# Altium schematic sheet Ethernet.SchDoc
size A3
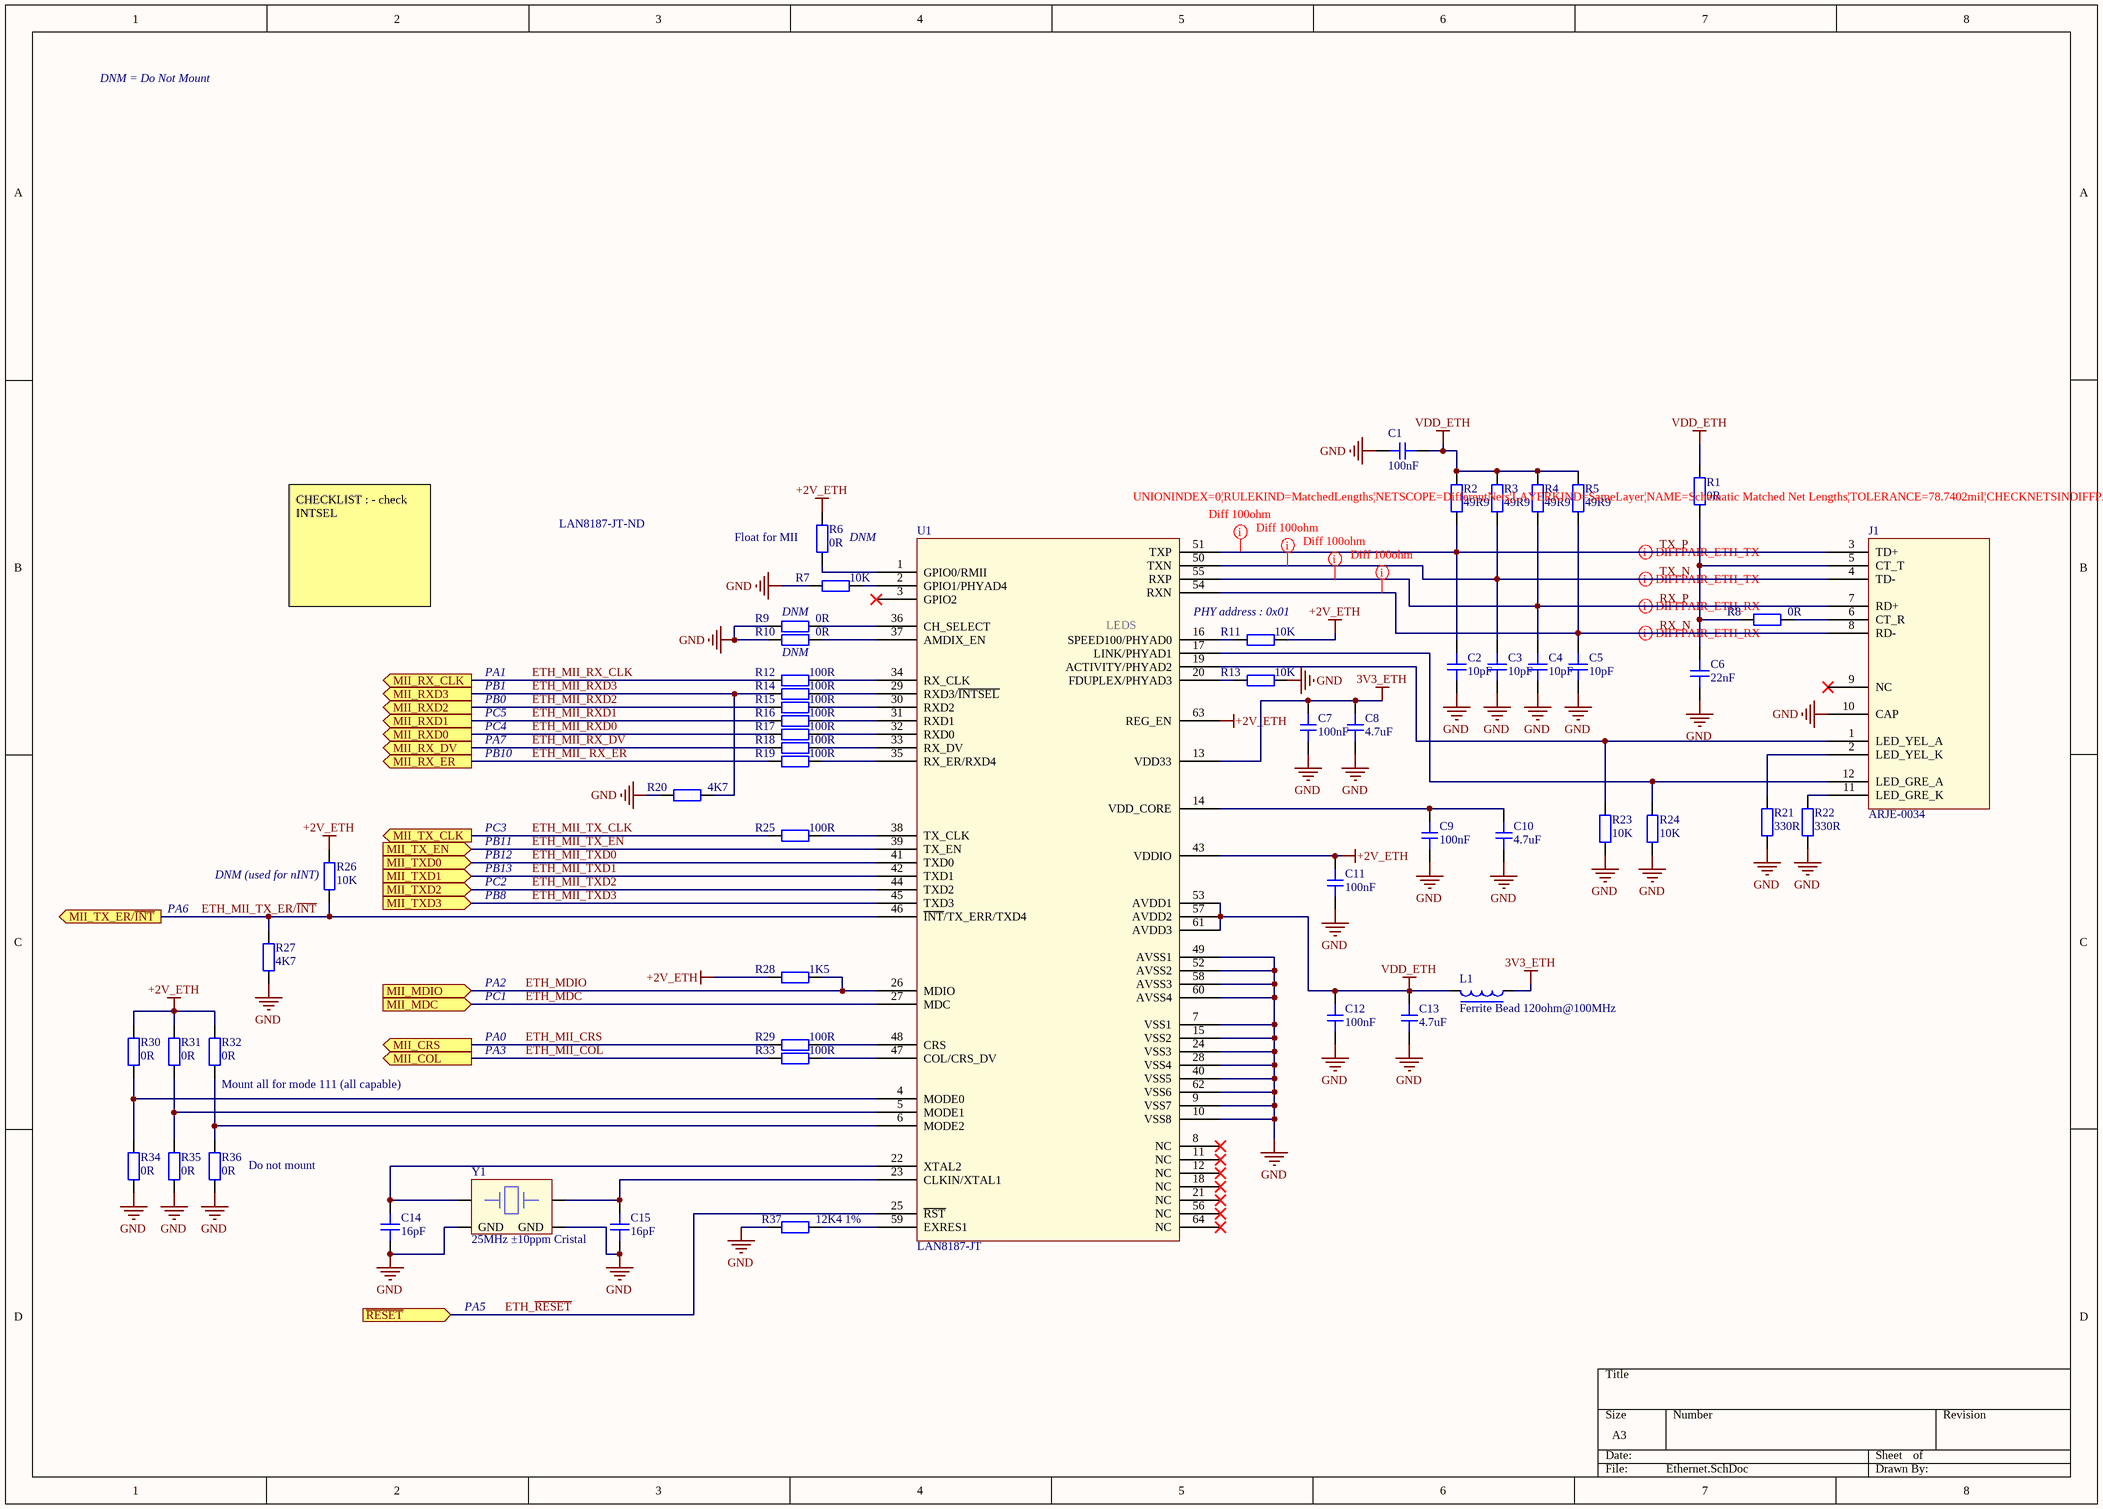
[diagram p0: Ethernet.SchDoc]

## Parts
C1  value 100nF  [Capacitor-0603]  (hidden comment: C-100nF-0603)
C2  value 10pF  [Capacitor-0603]  (hidden comment: C-10pF-0603)
C3  value 10pF  [Capacitor-0603]  (hidden comment: C-10pF-0603)
C4  value 10pF  [Capacitor-0603]  (hidden comment: C-10pF-0603)
C5  value 10pF  [Capacitor-0603]  (hidden comment: C-10pF-0603)
C6  value 22nF  [Capacitor-0603]  (hidden comment: C-22nF-0603)
C7  value 100nF  [Capacitor-0603]  (hidden comment: C-100nF-0603)
C8  value 4.7uF  [Capacitor-0603]  (hidden comment: C-4.7uF-0603)
C9  value 100nF  [Capacitor-0603]  (hidden comment: C-100nF-0603)
C10  value 4.7uF  [Capacitor-0603]  (hidden comment: C-4.7uF-0603)
C11  value 100nF  [Capacitor-0603]  (hidden comment: C-100nF-0603)
C12  value 100nF  [Capacitor-0603]  (hidden comment: C-100nF-0603)
C13  value 4.7uF  [Capacitor-0603]  (hidden comment: C-4.7uF-0603)
C14  value 16pF  [Capacitor-0603]  (hidden comment: C-16pF-0603)
C15  value 16pF  [Capacitor-0603]  (hidden comment: C-16pF-0603)
J1  ARJE-0034  [ARJE-0034]
L1  Ferrite Bead 120ohm@100MHz  [Inductor-0603]
R1  value 0R  [Resistor-0603]  (hidden comment: R-0R-0603)
R2  value 49R9  [Resistor-0603]  (hidden comment: R-49R9-0603)
R3  value 49R9  [Resistor-0603]  (hidden comment: R-49R9-0603)
R4  value 49R9  [Resistor-0603]  (hidden comment: R-49R9-0603)
R5  value 49R9  [Resistor-0603]  (hidden comment: R-49R9-0603)
R6  value 0R  [Resistor-0603]  (hidden comment: R-0R-0603)
R7  value 10K  [Resistor-0603]  (hidden comment: R-10K-0603)
R8  value 0R  [Resistor-0603]  (hidden comment: R-0R-0603)
R9  value 0R  [Resistor-0603]  (hidden comment: R-0R-0603)
R10  value 0R  [Resistor-0603]  (hidden comment: R-0R-0603)
R11  value 10K  [Resistor-0603]  (hidden comment: R-10K-0603)
R12  value 100R  [Resistor-0603]  (hidden comment: R-100R-0603)
R13  value 10K  [Resistor-0603]  (hidden comment: R-10K-0603)
R14  value 100R  [Resistor-0603]  (hidden comment: R-100R-0603)
R15  value 100R  [Resistor-0603]  (hidden comment: R-100R-0603)
R16  value 100R  [Resistor-0603]  (hidden comment: R-100R-0603)
R17  value 100R  [Resistor-0603]  (hidden comment: R-100R-0603)
R18  value 100R  [Resistor-0603]  (hidden comment: R-100R-0603)
R19  value 100R  [Resistor-0603]  (hidden comment: R-100R-0603)
R20  value 4K7  [Resistor-0603]  (hidden comment: R-4K7-0603)
R21  value 330R  [Resistor-0603]  (hidden comment: R-330R-0603)
R22  value 330R  [Resistor-0603]  (hidden comment: R-330R-0603)
R23  value 10K  [Resistor-0603]  (hidden comment: R-10K-0603)
R24  value 10K  [Resistor-0603]  (hidden comment: R-10K-0603)
R25  value 100R  [Resistor-0603]  (hidden comment: R-100R-0603)
R26  value 10K  [Resistor-0603]  (hidden comment: R-10K-0603)
R27  value 4K7  [Resistor-0603]  (hidden comment: R-4K7-0603)
R28  value 1K5  [Resistor-0603]  (hidden comment: R-1K5-0603)
R29  value 100R  [Resistor-0603]  (hidden comment: R-100R-0603)
R30  value 0R  [Resistor-0603]  (hidden comment: R-0R-0603)
R31  value 0R  [Resistor-0603]  (hidden comment: R-0R-0603)
R32  value 0R  [Resistor-0603]  (hidden comment: R-0R-0603)
R33  value 100R  [Resistor-0603]  (hidden comment: R-100R-0603)
R34  value 0R  [Resistor-0603]  (hidden comment: R-0R-0603)
R35  value 0R  [Resistor-0603]  (hidden comment: R-0R-0603)
R36  value 0R  [Resistor-0603]  (hidden comment: R-0R-0603)
R37  value 12K4 1%  [Resistor-0603]  (hidden comment: R-12K4-1%-0603)
U1  LAN8187-JT  Supplier Part Number 1: LAN8187-JT-ND  [LAN8187-JT]
Y1  25MHz ±10ppm Cristal  [830107871909]

## Ports
MII_COL (out), MII_CRS (out), MII_MDC (in), MII_MDIO (in), MII_RX_CLK (out), MII_RX_DV (out), MII_RX_ER (out), MII_RXD0 (out), MII_RXD1 (out), MII_RXD2 (out), MII_RXD3 (out), MII_TX_CLK (out), MII_TX_EN (in), MII_TX_ER/~{INT} (out), MII_TXD0 (in), MII_TXD1 (in), MII_TXD2 (in), MII_TXD3 (in), ~{RESET} (in)

## Nets
3V3_ETH: C7.2 C8.2 L1.2 U1.13(VDD33)
+2V_ETH: C11.2 R6.2 R11.2 R26.2 R28.1 R30.2 R31.2 R32.2 U1.43(VDDIO) U1.63(REG_EN)
GND: C1.1 C2.1 C3.1 C4.1 C5.1 C6.1 C7.1 C8.1 C9.1 C10.1 C11.1 C12.1 C13.1 C14.1 C15.1 J1.10(CAP) R7.1 R9.2 R10.2 R13.2 R20.1 R21.1 R22.1 R23.1 R24.1 R27.1 R34.1 R35.1 R36.1 R37.1 U1.7(VSS1) U1.9(VSS7) U1.10(VSS8) U1.15(VSS2) U1.24(VSS3) U1.28(VSS4) U1.40(VSS5) U1.49(AVSS1) U1.52(AVSS2) U1.58(AVSS3) U1.60(AVSS4) U1.62(VSS6) Y1.2(GND) Y1.4(GND)
VDD_ETH: C1.2 C12.2 C13.2 L1.1 R1.1 R2.2 R3.2 R4.2 R5.2 U1.53(AVDD1) U1.57(AVDD2) U1.61(AVDD3)
ETH_MDC: U1.27(MDC) ; port MII_MDC
ETH_MDIO: R28.2 U1.26(MDIO) ; port MII_MDIO
ETH_MII_ RX_ER: R19.1 ; port MII_RX_ER
ETH_MII_COL: R33.1 ; port MII_COL
ETH_MII_CRS: R29.1 ; port MII_CRS
ETH_MII_RX_CLK: R12.1 ; port MII_RX_CLK
ETH_MII_RX_DV: R18.1 ; port MII_RX_DV
ETH_MII_RXD0: R17.1 ; port MII_RXD0
ETH_MII_RXD1: R16.1 ; port MII_RXD1
ETH_MII_RXD2: R15.1 ; port MII_RXD2
ETH_MII_RXD3: R14.1 R20.2 ; port MII_RXD3
ETH_MII_TX_CLK: R25.1 ; port MII_TX_CLK
ETH_MII_TX_EN: U1.39(TX_EN) ; port MII_TX_EN
ETH_MII_TX_ER/~{INT}: R26.1 R27.2 U1.46(~{INT}/TX_ERR/TXD4) ; port MII_TX_ER/~{INT}
ETH_MII_TXD0: U1.41(TXD0) ; port MII_TXD0
ETH_MII_TXD1: U1.42(TXD1) ; port MII_TXD1
ETH_MII_TXD2: U1.44(TXD2) ; port MII_TXD2
ETH_MII_TXD3: U1.45(TXD3) ; port MII_TXD3
ETH_~{RESET}: U1.25(~{RST}) ; port ~{RESET}
RX_N: C5.2 J1.8(RD-) R5.1 U1.54(RXN)
RX_P: C4.2 J1.7(RD+) R4.1 U1.55(RXP)
TX_N: C3.2 J1.4(TD-) R3.1 U1.50(TXN)
TX_P: C2.2 J1.3(TD+) R2.1 U1.51(TXP)
NetC6_2: C6.2 J1.5(CT_T) R1.2 R8.2
NetC9_2: C9.2 C10.2 U1.14(VDD_CORE)
NetC14_2: C14.2 U1.22(XTAL2) Y1.1(GND)
NetC15_2: C15.2 U1.23(CLKIN/XTAL1) Y1.3(XTAL2)
NetJ1_1: J1.1(LED_YEL_A) R23.2 U1.19(ACTIVITY/PHYAD2)
NetJ1_2: J1.2(LED_YEL_K) R21.2
NetJ1_6: J1.6(CT_R) R8.1
NetJ1_11: J1.11(LED_GRE_K) R22.2
NetJ1_12: J1.12(LED_GRE_A) R24.2 U1.17(LINK/PHYAD1)
NetR6_1: R6.1 U1.1(GPIO0/RMII)
NetR7_2: R7.2 U1.2(GPIO1/PHYAD4)
NetR9_1: R9.1 U1.36(CH_SELECT)
NetR10_1: R10.1 U1.37(AMDIX_EN)
NetR11_1: R11.1 U1.16(SPEED100/PHYAD0)
NetR12_2: R12.2 U1.34(RX_CLK)
NetR13_1: R13.1 U1.20(FDUPLEX/PHYAD3)
NetR14_2: R14.2 U1.29(RXD3/~{INTSEL})
NetR15_2: R15.2 U1.30(RXD2)
NetR16_2: R16.2 U1.31(RXD1)
NetR17_2: R17.2 U1.32(RXD0)
NetR18_2: R18.2 U1.33(RX_DV)
NetR19_2: R19.2 U1.35(RX_ER/RXD4)
NetR25_2: R25.2 U1.38(TX_CLK)
NetR29_2: R29.2 U1.48(CRS)
NetR30_1: R30.1 R34.2 U1.4(MODE0)
NetR31_1: R31.1 R35.2 U1.5(MODE1)
NetR32_1: R32.1 R36.2 U1.6(MODE2)
NetR33_2: R33.2 U1.47(COL/CRS_DV)
NetR37_2: R37.2 U1.59(EXRES1)

Not connected (* = marked no-connect by the designer): J1 9(NC)*; U1 3(GPIO2)* 8(NC)* 11(NC)* 12(NC)* 18(NC)* 21(NC)* 56(NC)* 64(NC)*

## Layout directives
differential pair: RX_N, RX_P, TX_N, TX_P
rule Matched Net Lengths [Tolerance = 2mm]; rule Differential Pairs Routing [Pref Gap = 0.2mm    Min Gap  = 0.2mm    Max Gap  = 0.2mmPref Width = 0.3mm    Min Width  = 0.3mm    Max Width  = 0.3mm]: RX_N, RX_P, TX_N, TX_P

## Notes on the sheet
- DNM = Do Not Mount
- (near R6) Float for MII
- DNM
- CHECKLIST : - check INTSEL
- (near R9) DNM
- PHY address : 0x01
- PA1
- PB1
- PB0
- PC5
- (near R10) DNM
- PC4
- PA7
- PB10
- PC3
- PB11
- PB12
- PA6
- (near R26) DNM (used for nINT)
- PB13
- PC2
- PB8
- PA2
- PC1
- PA0
- PA3
- (near R32) Mount all for mode 111 (all capable)
- (near R36) Do not mount
- PA5
- (in symbol LAN8187-JT) LEDS

## Library data of the parts
L1 = PE-0603PFB121ST: Supplier 1: Digi-Key; Supplier Part Number 1: 553-2387-1-ND
Y1 = 830107871909: Supplier 1: Digi-Key; Supplier Part Number 1: 1923-830107871909CT-ND
C1 C7 C9 C11 C12 = C-100nF-0603: Supplier 1: Digi-Key; Supplier Part Number 1: 1276-1006-1-ND
C2-C5 = C-10pF-0603: Supplier 1: Digi-Key; Supplier Part Number 1: 478-1163-1-ND
C6 = C-22nF-0603: Supplier 1: Digi-Key; Supplier Part Number 1: 445-5663-1-ND
C8 C10 C13 = C-4.7uF-0603: Supplier 1: Digi-Key; Supplier Part Number 1: 490-7203-1-ND
C14 C15 = C-16pF-0603: Supplier 1: Digi-Key; Supplier Part Number 1: 1292-1490-1-ND
J1 = ARJE-0034: Supplier 1: Digi-Key; Supplier Part Number 1: 535-12443-1-ND
R1 R6 R8-R10 R30-R32 R34-R36 = R-0R-0603: Supplier 1: Digi-Key; Supplier Part Number 1: RMCF0603ZT0R00CT-ND
R2-R5 = R-49R9-0603: Supplier 1: Digi-Key; Supplier Part Number 1: RMCF0603FT49R9CT-ND
R7 R11 R13 R23 R24 R26 = R-10K-0603: Supplier 1: Digi-Key; Supplier Part Number 1: 311-10.0KHRCT-ND
R12 R14-R19 R25 R29 R33 = R-100R-0603: Supplier 1: Digi-Key; Supplier Part Number 1: 311-100HRCT-ND
R20 R27 = R-4K7-0603: Supplier 1: Digi-Key; Supplier Part Number 1: 311-4.70KHRCT-ND
R21 R22 = R-330R-0603: Supplier 1: Digi-Key; Supplier Part Number 1: 311-330HRCT-ND
R28 = R-1K5-0603: Supplier 1: Digi-Key; Supplier Part Number 1: 311-1.50KHRCT-ND
R37 = R-12K4-1%-0603: Supplier 1: Digi-Key; Supplier Part Number 1: RMCF0603FT12K4CT-ND
U1 = LAN8187-JT: Supplier 1: Digi-Key